# Altium schematic sheet Main Schematics.SchDoc (part 3 of 3)
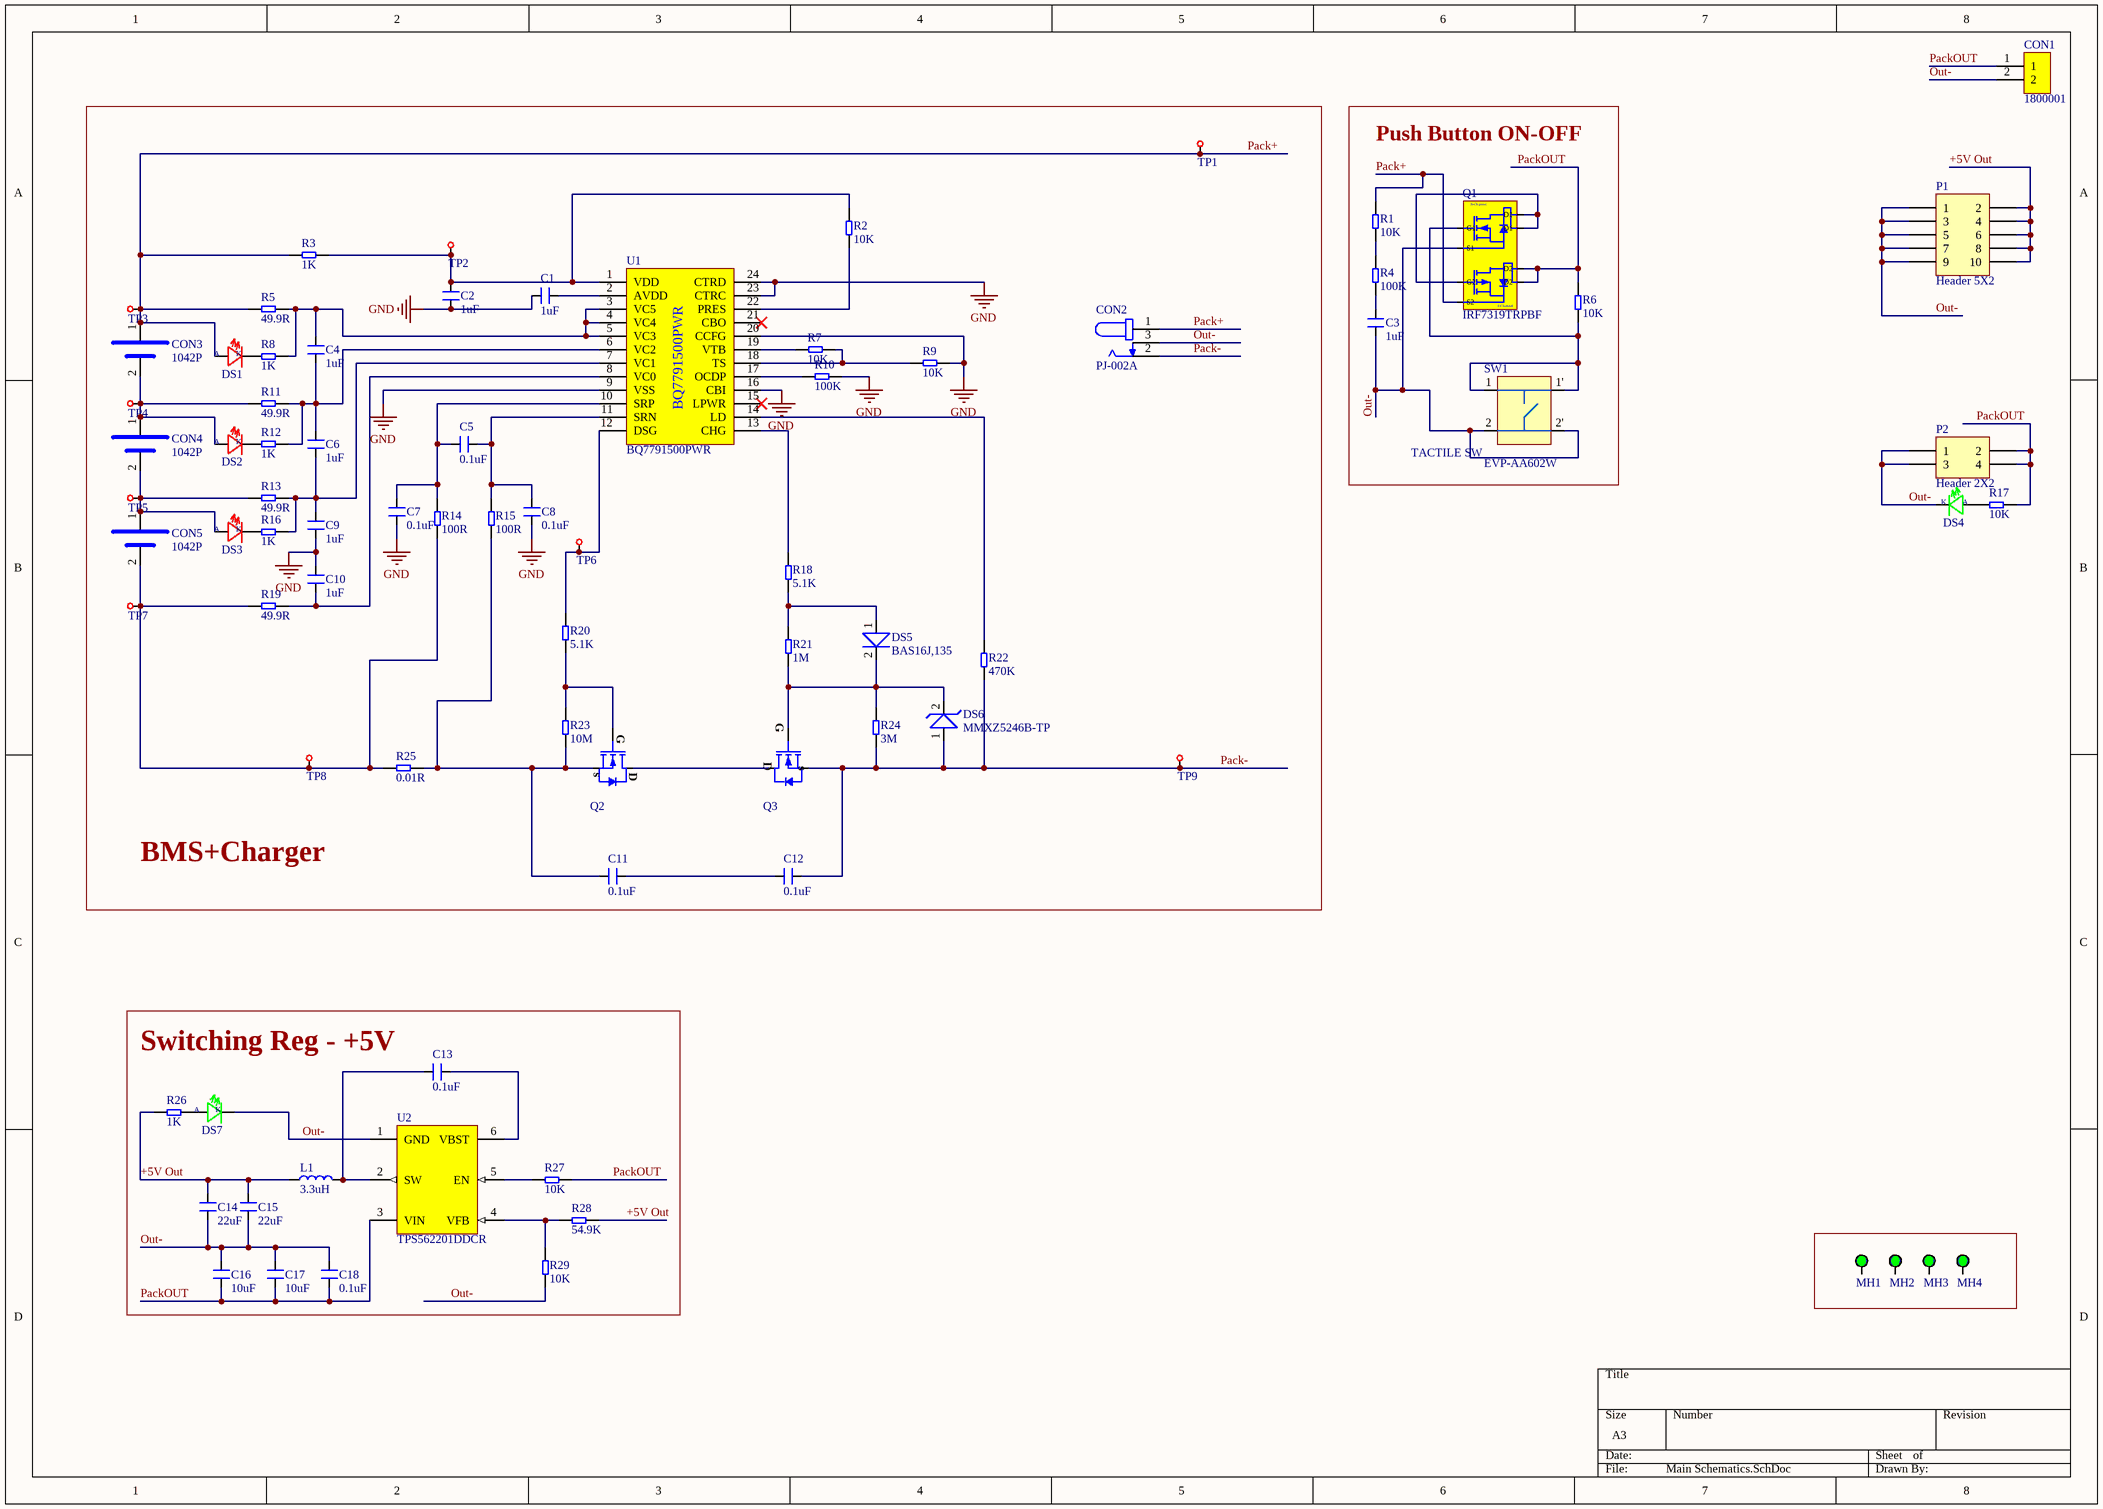
[diagram p2: Main Schematics.SchDoc]

## Library data of the parts (continued)
SW1 = SW_SPST_NO_EVP-AA602W_SMT: SWITCH TACTILE SPST-NO 0.02A 15V; Manufacturer: Panasonic; Supplier 1: Mouser; Manufacturer Part Number: EVP-AA602W; RoHS: Yes; Category: Tactile Switches; Stock 1: 3156; Pricing 1: 1=0.86, 10=0.818, 50=0.802, 100=0.682, 1000=0.498, 10000=0.461 (USD); ComponentLink1URL: https://datasheet.ciiva.com/30071/atk0000ce26-30071612.pdf?src-supplier=Onlinecomponents.com; ComponentLink1Description: https://datasheet.ciiva.com/30071/atk0000ce26-30071612.pdf?src-supplier=Onlinecomponents.com; ComponentLink2URL: https://datasheet.ciiva.com/16212/atk0000ce26-16212136.pdf?src-supplier=Future+Electronics; ComponentLink2Description: https://datasheet.ciiva.com/16212/atk0000ce26-16212136.pdf?src-supplier=Future+Electronics; ComponentLink3URL: https://datasheet.ciiva.com/2899/atk0000ce26-2899984.pdf?src-supplier=Digi-Key; ComponentLink3Description: https://datasheet.ciiva.com/2899/atk0000ce26-2899984.pdf?src-supplier=Digi-Key; ComponentLink4URL: https://datasheet.ciiva.com/2899/atk0000ce26-2899985.pdf?src-supplier=Digi-Key; ComponentLink4Description: https://datasheet.ciiva.com/2899/atk0000ce26-2899985.pdf?src-supplier=Digi-Key; ComponentLink5URL: https://datasheet.ciiva.com/2899/atk0000ce26-2899986.pdf?src-supplier=Digi-Key; ComponentLink5Description: https://datasheet.ciiva.com/2899/atk0000ce26-2899986.pdf?src-supplier=Digi-Key; Supplier 2: Digi-Key; Manufacturer 2: Panasonic; Manufacturer Part Number 2: EVP-AA602W; Stock 2: 74087; Pricing 2: 1=0.79, 10=0.759, 25=0.7296, 100=0.6334, 250=0.57796, 500=0.53708, 1000=0.48162, 2500=0.45243 (USD); ComponentLink6URL: https://datasheet.ciiva.com/25603/0900766b810ad3e5-25603922.pdf?src-supplier=Rs; ComponentLink6Description: https://datasheet.ciiva.com/25603/0900766b810ad3e5-25603922.pdf?src-supplier=Rs; ComponentLink7URL: https://datasheet.ciiva.com/8166/atk0000ce26-8166426.pdf?src-supplier=Avnet; ComponentLink7Description: https://datasheet.ciiva.com/8166/atk0000ce26-8166426.pdf?src-supplier=Avnet; Supplier Part Number 2: 10-EVP-AA602WCT-ND
TP1-TP9 = Test Point SMD Round 1.27mm: Testpoint SMD Round
U1 = IC_BMS_3S_BQ77915_24TSSOP: Battery Protection Li-Ion/Li-Polymer 1mA 0V to 25V 24-Pin TSSOP T/R; Manufacturer 1: Texas Instruments; Supplier 1: Digi-Key; Manufacturer Part Number 1: BQ7791500PWR; RoHS: Yes; Category: Battery Management; Stock 1: 2285; Pricing 1: 1=1.72, 10=1.547, 25=1.4596, 100=1.2435, 250=1.16756, 500=1.02162, 1000=0.84648 (USD); ComponentLink1URL: http://www.ti.com/lit/ds/symlink/bq77915.pdf?src-supplier=Digi-Key; ComponentLink1Description: http://www.ti.com/lit/ds/symlink/bq77915.pdf?src-supplier=Digi-Key; ComponentLink2URL: http://www.ti.com/general/docs/suppproductinfo.tsp?distId=10&amp;gotoUrl=http%3A%2F%2Fwww.ti.com%2Flit%2Fgpn%2Fbq77915&src-supplier=Digi-Key; ComponentLink2Description: http://www.ti.com/general/docs/suppproductinfo.tsp?distId=10&amp;gotoUrl=http%3A%2F%2Fwww.ti.com%2Flit%2Fgpn%2Fbq77915&src-supplier=Digi-Key; Supplier Part Number 1: 296-50995-1-ND
U2 = REG_ADJ-0.768V-7V_2A_SOT23-6: IC REG BUCK ADJ 2A SYNC SOT6; Manufacturer 1: Texas Instruments; Quiescent Current: 400uA; Number of Outputs: 1; Max Input Voltage: 17V; Switching Frequency: 580kHz; Min Input Voltage: 4.5V; Output Type: Adjustable; Output Configuration: Positive; Min Output Voltage: 768mV; Max Output Voltage: 7V; Synchronous Rectifier: Yes; Supplier 1: Digi-Key; Manufacturer Part Number 1: TPS562201DDCR; RoHS: Yes; Category: Voltage Regulators - Switching; Stock 1: 86271; Pricing 1: 1=0.39, 10=0.318, 25=0.2908, 100=0.2165, 250=0.19624, 500=0.1624, 1000=0.12181 (USD); Mount: Surface Mount; Case/Package: SOT-23-6; Number of Pins: 6; Min Operating Temperature: -40°C; Max Operating Temperature: 125°C; Series: D-CAP2™, Eco-Mode™; Packaging: Cut Tape; Output Current: 2A; Lead Free: Lead Free; RoHS Compliant: Yes; ComponentLink1URL: http://www.ti.com/lit/ds/symlink/tps562201.pdf?src-supplier=Digi-Key; ComponentLink1Description: http://www.ti.com/lit/ds/symlink/tps562201.pdf?src-supplier=Digi-Key; ComponentLink2URL: http://www.ti.com/lit/gpn/tps562201?src-supplier=Mouser; ComponentLink2Description: http://www.ti.com/lit/gpn/tps562201?src-supplier=Mouser; Supplier Part Number 1: 296-44397-1-ND

## Notes on the sheet
- (in symbol LED_Green_0603_2.2V_HSMG-C190) A; K
- (in symbol LED_Red_0603_2.2V_HSMS-C190) A; K
- (in symbol MOSFET-Dual_P/N-30V) N-Channel; P-Channel
- (in symbol MOSFET-N_60V-50A_VSONP-8) s
- (in symbol SW_SPST_NO_EVP-AA602W_SMT) TACTILE SW